# EAGLE schematic BMS_25 (EAGLE 9.6.2)
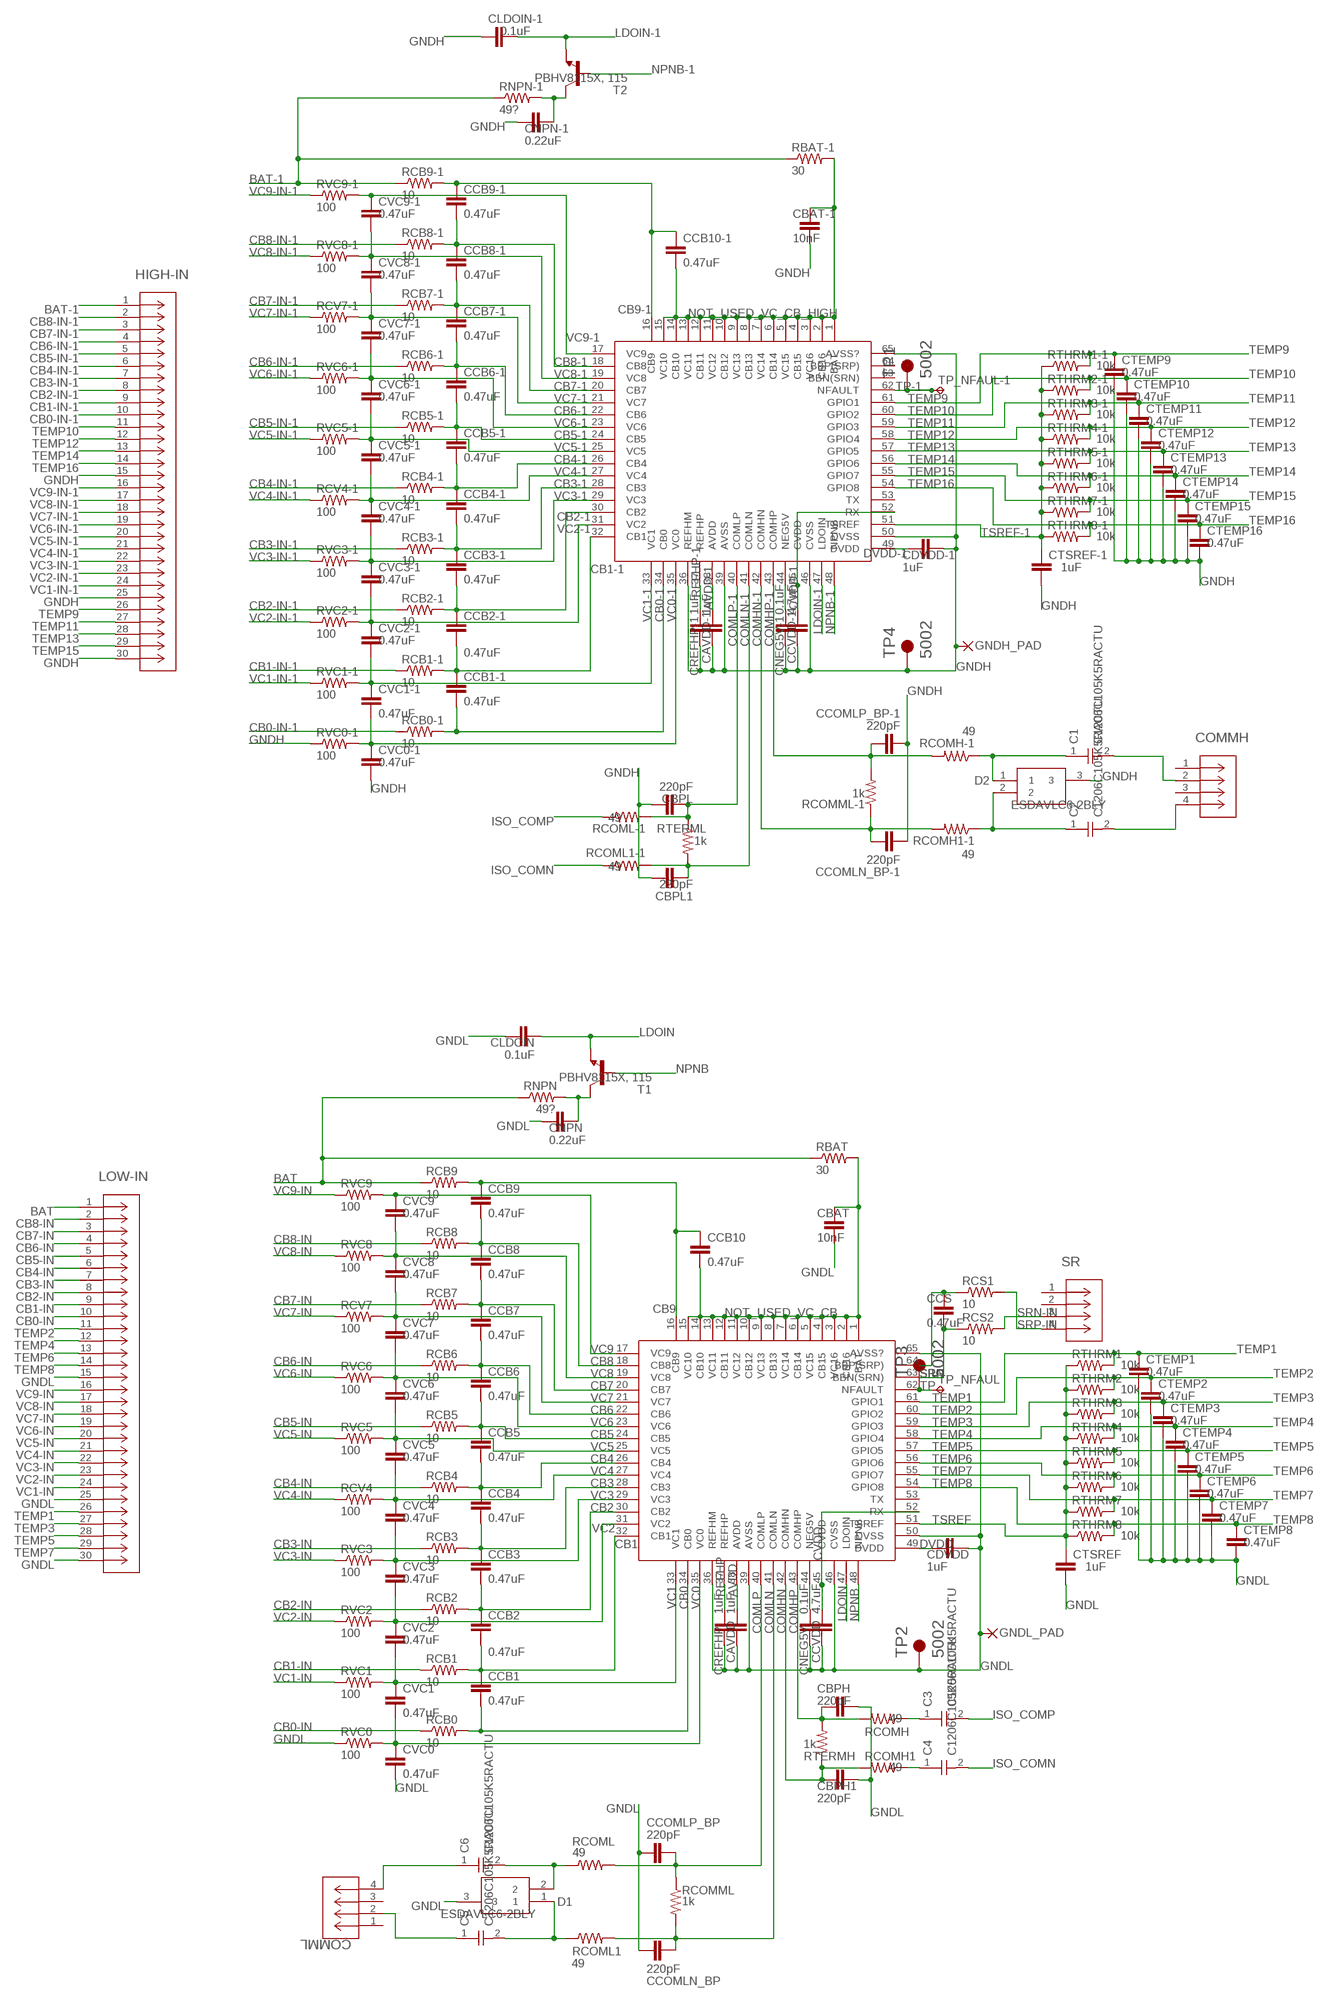
[diagram p0: schematic, sheet 1]

## Parts
C1  C1206C105K5RACTU  [CAPC3216X120N]
C2  C1206C105K5RACTU  [CAPC3216X120N]
C3  C1206C105K5RACTU  [CAPC3216X120N]
C4  C1206C105K5RACTU  [CAPC3216X120N]
C5  C1206C105K5RACTU  [CAPC3216X120N]
C6  C1206C105K5RACTU  [CAPC3216X120N]
CAVDD  1uF  CAPACITORC0603  [C0603]
CAVDD-1  1uF  CAPACITORC0603  [C0603]
CBAT  10nF  CAPACITORC0603  [C0603]
CBAT-1  10nF  CAPACITORC0603  [C0603]
CBPH  220pF  CAPACITORC0603  [C0603]
CBPH1  220pF  CAPACITORC0603  [C0603]
CBPL  220pF  CAPACITORC0603  [C0603]
CBPL1  220pF  CAPACITORC0603  [C0603]
CCB1  0.47uF  CAPACITORC0603  [C0603]
CCB1-1  0.47uF  CAPACITORC0603  [C0603]
CCB2  0.47uF  CAPACITORC0603  [C0603]
CCB2-1  0.47uF  CAPACITORC0603  [C0603]
CCB3  0.47uF  CAPACITORC0603  [C0603]
CCB3-1  0.47uF  CAPACITORC0603  [C0603]
CCB4  0.47uF  CAPACITORC0603  [C0603]
CCB4-1  0.47uF  CAPACITORC0603  [C0603]
CCB5  0.47uF  CAPACITORC0603  [C0603]
CCB5-1  0.47uF  CAPACITORC0603  [C0603]
CCB6  0.47uF  CAPACITORC0603  [C0603]
CCB6-1  0.47uF  CAPACITORC0603  [C0603]
CCB7  0.47uF  CAPACITORC0603  [C0603]
CCB7-1  0.47uF  CAPACITORC0603  [C0603]
CCB8  0.47uF  CAPACITORC0603  [C0603]
CCB8-1  0.47uF  CAPACITORC0603  [C0603]
CCB9  0.47uF  CAPACITORC0603  [C0603]
CCB9-1  0.47uF  CAPACITORC0603  [C0603]
CCB10  0.47uF  CAPACITORC0603  [C0603]
CCB10-1  0.47uF  CAPACITORC0603  [C0603]
CCOMLN_BP  220pF  CAPACITORC0603  [C0603]
CCOMLN_BP-1  220pF  CAPACITORC0603  [C0603]
CCOMLP_BP  220pF  CAPACITORC0603  [C0603]
CCOMLP_BP-1  220pF  CAPACITORC0603  [C0603]
CCS  0.47uF  CAPACITORC0603  [C0603]
CCVDD  4.7uF  CAPACITORC0603  [C0603]
CCVDD-1  4.7uF  CAPACITORC0603  [C0603]
CDVDD  1uF  CAPACITORC0603  [C0603]
CDVDD-1  1uF  CAPACITORC0603  [C0603]
CLDOIN  0.1uF  CAPACITORC0603  [C0603]
CLDOIN-1  0.1uF  CAPACITORC0603  [C0603]
CNEG5V  0.1uF  CAPACITORC0603  [C0603]
CNEG5V-1  0.1uF  CAPACITORC0603  [C0603]
CNPN  0.22uF  CAPACITORC0603  [C0603]
CNPN-1  0.22uF  CAPACITORC0603  [C0603]
COMMH  DF11-4DP-2DSA(24)  [CON4_2X2_UF_DF11_HIR]
COMML  DF11-4DP-2DSA(24)  [CON4_2X2_UF_DF11_HIR]
CREFHP  1uF  CAPACITORC0603  [C0603]
CREFHP-1  1uF  CAPACITORC0603  [C0603]
CTEMP1  0.47uF  CAPACITORC0603  [C0603]
CTEMP2  0.47uF  CAPACITORC0603  [C0603]
CTEMP3  0.47uF  CAPACITORC0603  [C0603]
CTEMP4  0.47uF  CAPACITORC0603  [C0603]
CTEMP5  0.47uF  CAPACITORC0603  [C0603]
CTEMP6  0.47uF  CAPACITORC0603  [C0603]
CTEMP7  0.47uF  CAPACITORC0603  [C0603]
CTEMP8  0.47uF  CAPACITORC0603  [C0603]
CTEMP9  0.47uF  CAPACITORC0603  [C0603]
CTEMP10  0.47uF  CAPACITORC0603  [C0603]
CTEMP11  0.47uF  CAPACITORC0603  [C0603]
CTEMP12  0.47uF  CAPACITORC0603  [C0603]
CTEMP13  0.47uF  CAPACITORC0603  [C0603]
CTEMP14  0.47uF  CAPACITORC0603  [C0603]
CTEMP15  0.47uF  CAPACITORC0603  [C0603]
CTEMP16  0.47uF  CAPACITORC0603  [C0603]
CTSREF  1uF  CAPACITORC0603  [C0603]
CTSREF-1  1uF  CAPACITORC0603  [C0603]
CVC0  0.47uF  CAPACITORC0603  [C0603]
CVC0-1  0.47uF  CAPACITORC0603  [C0603]
CVC1  0.47uF  CAPACITORC0603  [C0603]
CVC1-1  0.47uF  CAPACITORC0603  [C0603]
CVC2  0.47uF  CAPACITORC0603  [C0603]
CVC2-1  0.47uF  CAPACITORC0603  [C0603]
CVC3  0.47uF  CAPACITORC0603  [C0603]
CVC3-1  0.47uF  CAPACITORC0603  [C0603]
CVC4  0.47uF  CAPACITORC0603  [C0603]
CVC4-1  0.47uF  CAPACITORC0603  [C0603]
CVC5  0.47uF  CAPACITORC0603  [C0603]
CVC5-1  0.47uF  CAPACITORC0603  [C0603]
CVC6  0.47uF  CAPACITORC0603  [C0603]
CVC6-1  0.47uF  CAPACITORC0603  [C0603]
CVC7  0.47uF  CAPACITORC0603  [C0603]
CVC7-1  0.47uF  CAPACITORC0603  [C0603]
CVC8  0.47uF  CAPACITORC0603  [C0603]
CVC8-1  0.47uF  CAPACITORC0603  [C0603]
CVC9  0.47uF  CAPACITORC0603  [C0603]
CVC9-1  0.47uF  CAPACITORC0603  [C0603]
D1  ESDAVLC6-2BLY  [SOT95P255X150-3N]
D2  ESDAVLC6-2BLY  [SOT95P255X150-3N]
GNDH_PAD  SMD2  [SMD1,27-2,54]
GNDL_PAD  SMD2  [SMD1,27-2,54]
HIGH-IN  87606-315LF  [87606-315LF_AMP]
IC1  PBQ79656PAPTQ1  [QFP50P1200X1200X120-65N]
IC2  PBQ79656PAPTQ1  [QFP50P1200X1200X120-65N]
LOW-IN  87606-315LF  [87606-315LF_AMP]
RBAT  30  RESISTORR0603  [R0603]
RBAT-1  30  RESISTORR0603  [R0603]
RCB0  10  R-US_R2010  [R2010]
RCB0-1  10  R-US_R2010  [R2010]
RCB1  10  R-US_R2010  [R2010]
RCB1-1  10  R-US_R2010  [R2010]
RCB2  10  R-US_R2010  [R2010]
RCB2-1  10  R-US_R2010  [R2010]
RCB3  10  R-US_R2010  [R2010]
RCB3-1  10  R-US_R2010  [R2010]
RCB4  10  R-US_R2010  [R2010]
RCB4-1  10  R-US_R2010  [R2010]
RCB5  10  R-US_R2010  [R2010]
RCB5-1  10  R-US_R2010  [R2010]
RCB6  10  R-US_R2010  [R2010]
RCB6-1  10  R-US_R2010  [R2010]
RCB7  10  R-US_R2010  [R2010]
RCB7-1  10  R-US_R2010  [R2010]
RCB8  10  R-US_R2010  [R2010]
RCB8-1  10  R-US_R2010  [R2010]
RCB9  10  R-US_R2010  [R2010]
RCB9-1  10  R-US_R2010  [R2010]
RCOMH  49  RESISTORR0603  [R0603]
RCOMH1  49  RESISTORR0603  [R0603]
RCOMH1-1  49  RESISTORR0603  [R0603]
RCOMH-1  49  RESISTORR0603  [R0603]
RCOML  49  RESISTORR0603  [R0603]
RCOML1  49  RESISTORR0603  [R0603]
RCOML1-1  49  RESISTORR0603  [R0603]
RCOML-1  49  RESISTORR0603  [R0603]
RCOMML  1k  RESISTORR0603  [R0603]
RCOMML-1  1k  RESISTORR0603  [R0603]
RCS1  10  RESISTORR0603  [R0603]
RCS2  10  RESISTORR0603  [R0603]
RCV4  100  RESISTORR0603  [R0603]
RCV4-1  100  RESISTORR0603  [R0603]
RCV7  100  RESISTORR0603  [R0603]
RCV7-1  100  RESISTORR0603  [R0603]
RNPN  49?  RESISTORR0603  [R0603]
RNPN-1  49?  RESISTORR0603  [R0603]
RTERMH  1k  RESISTORR0603  [R0603]
RTERML  1k  RESISTORR0603  [R0603]
RTHRM1  10k  RESISTORR0603  [R0603]
RTHRM1-1  10k  RESISTORR0603  [R0603]
RTHRM2  10k  RESISTORR0603  [R0603]
RTHRM2-1  10k  RESISTORR0603  [R0603]
RTHRM3  10k  RESISTORR0603  [R0603]
RTHRM3-1  10k  RESISTORR0603  [R0603]
RTHRM4  10k  RESISTORR0603  [R0603]
RTHRM4-1  10k  RESISTORR0603  [R0603]
RTHRM5  10k  RESISTORR0603  [R0603]
RTHRM5-1  10k  RESISTORR0603  [R0603]
RTHRM6  10k  RESISTORR0603  [R0603]
RTHRM6-1  10k  RESISTORR0603  [R0603]
RTHRM7  10k  RESISTORR0603  [R0603]
RTHRM7-1  10k  RESISTORR0603  [R0603]
RTHRM8  10k  RESISTORR0603  [R0603]
RTHRM8-1  10k  RESISTORR0603  [R0603]
RVC0  100  RESISTORR0603  [R0603]
RVC0-1  100  RESISTORR0603  [R0603]
RVC1  100  RESISTORR0603  [R0603]
RVC1-1  100  RESISTORR0603  [R0603]
RVC2  100  RESISTORR0603  [R0603]
RVC2-1  100  RESISTORR0603  [R0603]
RVC3  100  RESISTORR0603  [R0603]
RVC3-1  100  RESISTORR0603  [R0603]
RVC5  100  RESISTORR0603  [R0603]
RVC5-1  100  RESISTORR0603  [R0603]
RVC6  100  RESISTORR0603  [R0603]
RVC6-1  100  RESISTORR0603  [R0603]
RVC8  100  RESISTORR0603  [R0603]
RVC8-1  100  RESISTORR0603  [R0603]
RVC9  100  RESISTORR0603  [R0603]
RVC9-1  100  RESISTORR0603  [R0603]
SR  DF11-4DP-2DSA(24)  [CON4_2X2_UF_DF11_HIR]
T1  PBHV8115X, 115  BC868-NPN-SOT89-BCE  [SOT89-BCE]
T2  PBHV8115X, 115  BC868-NPN-SOT89-BCE  [SOT89-BCE]
TP1  5002  [KEYSTONE_5002]
TP2  5002  [KEYSTONE_5002]
TP3  5002  [KEYSTONE_5002]
TP4  5002  [KEYSTONE_5002]
TP_NFAUL  TPB2,54  [B2,54]
TP_NFAUL-1  TPB2,54  [B2,54]

## Nets
AVDD: CAVDD.1 IC2.38(AVDD)
AVDD-1: CAVDD-1.1 IC1.38(AVDD)
BAT: LOW-IN.1 RBAT.1 RCB9.1 RNPN.1
BAT-1: HIGH-IN.1 RBAT-1.1 RCB9-1.1 RNPN-1.1
CB0: CCB1.2 IC2.34(CB0) RCB0.2
CB0-1: CCB1-1.2 IC1.34(CB0) RCB0-1.2
CB0-IN: LOW-IN.10 RCB0.1
CB0-IN-1: HIGH-IN.10 RCB0-1.1
CB1: CCB1.1 CCB2.2 IC2.32(CB1) RCB1.2
CB1-1: CCB1-1.1 CCB2-1.2 IC1.32(CB1) RCB1-1.2
CB1-IN: LOW-IN.9 RCB1.1
CB1-IN-1: HIGH-IN.9 RCB1-1.1
CB2: CCB2.1 CCB3.2 IC2.30(CB2) RCB2.2
CB2-1: CCB2-1.1 CCB3-1.2 IC1.30(CB2) RCB2-1.2
CB2-IN: LOW-IN.8 RCB2.1
CB2-IN-1: HIGH-IN.8 RCB2-1.1
CB3: CCB3.1 CCB4.2 IC2.28(CB3) RCB3.2
CB3-1: CCB3-1.1 CCB4-1.2 IC1.28(CB3) RCB3-1.2
CB3-IN: LOW-IN.7 RCB3.1
CB3-IN-1: HIGH-IN.7 RCB3-1.1
CB4: CCB4.1 CCB5.2 IC2.26(CB4) RCB4.2
CB4-1: CCB4-1.1 CCB5-1.2 IC1.26(CB4) RCB4-1.2
CB4-IN: LOW-IN.6 RCB4.1
CB4-IN-1: HIGH-IN.6 RCB4-1.1
CB5: CCB5.1 CCB6.2 IC2.24(CB5) RCB5.2
CB5-1: CCB5-1.1 CCB6-1.2 IC1.24(CB5) RCB5-1.2
CB5-IN: LOW-IN.5 RCB5.1
CB5-IN-1: HIGH-IN.5 RCB5-1.1
CB6: CCB6.1 CCB7.2 IC2.22(CB6) RCB6.2
CB6-1: CCB6-1.1 CCB7-1.2 IC1.22(CB6) RCB6-1.2
CB6-IN: LOW-IN.4 RCB6.1
CB6-IN-1: HIGH-IN.4 RCB6-1.1
CB7: CCB7.1 CCB8.2 IC2.20(CB7) RCB7.2
CB7-1: CCB7-1.1 CCB8-1.2 IC1.20(CB7) RCB7-1.2
CB7-IN: LOW-IN.3 RCB7.1
CB7-IN-1: HIGH-IN.3 RCB7-1.1
CB8: CCB8.1 CCB9.2 IC2.18(CB8) RCB8.2
CB8-1: CCB8-1.1 CCB9-1.2 IC1.18(CB8) RCB8-1.2
CB8-IN: LOW-IN.2 RCB8.1
CB8-IN-1: HIGH-IN.2 RCB8-1.1
CB9: CCB9.1 CCB10.2 IC2.16(CB9) RCB9.2
CB9-1: CCB9-1.1 CCB10-1.2 IC1.16(CB9) RCB9-1.2
COMHN: CBPH1.1 IC2.42(COMHN) RCOMH1.2 RTERMH.1
COMHN-1: CCOMLN_BP-1.1 IC1.42(COMHN) RCOMH1-1.2 RCOMML-1.1
COMHP: CBPH.1 IC2.43(COMHP) RCOMH.2 RTERMH.2
COMHP-1: CCOMLP_BP-1.1 IC1.43(COMHP) RCOMH-1.2 RCOMML-1.2
COMLN: CCOMLN_BP.1 IC2.41(COMLN) RCOML1.2 RCOMML.2
COMLN-1: CBPL1.1 IC1.41(COMLN) RCOML1-1.2 RTERML.2
COMLP: CCOMLP_BP.1 IC2.40(COMLP) RCOML.2 RCOMML.1
COMLP-1: CBPL.1 IC1.40(COMLP) RCOML-1.2 RTERML.1
CVDD: CCVDD.1 IC2.45(CVDD) IC2.52(RX)
CVDD-1: CCVDD-1.1 IC1.45(CVDD) IC1.52(RX)
DVDD: CDVDD.1 IC2.49(DVDD)
DVDD-1: CDVDD-1.1 IC1.49(DVDD)
GNDH: CAVDD-1.2 CBAT-1.1 CBPL1.2 CBPL.2 CCOMLN_BP-1.2 CCOMLP_BP-1.2 CCVDD-1.2 CDVDD-1.2 CLDOIN-1.2 CNEG5V-1.2 CNPN-1.1 CREFHP-1.2 CTEMP9.2 CTEMP10.2 CTEMP11.2 CTEMP12.2 CTEMP13.2 CTEMP14.2 CTEMP15.2 CTEMP16.2 CTSREF-1.2 CVC0-1.2 D2.3 GNDH_PAD.1(P) HIGH-IN.15 HIGH-IN.25 HIGH-IN.30 IC1.36(REFHM) IC1.39(AVSS) IC1.46(CVSS) IC1.50(DVSS) IC1.65(AVSS?) RVC0-1.1 TP4.TP
GNDL: CAVDD.2 CBAT.1 CBPH1.2 CBPH.2 CCOMLN_BP.2 CCOMLP_BP.2 CCVDD.2 CDVDD.2 CLDOIN.2 CNEG5V.2 CNPN.1 CREFHP.2 CTEMP1.2 CTEMP2.2 CTEMP3.2 CTEMP4.2 CTEMP5.2 CTEMP6.2 CTEMP7.2 CTEMP8.2 CTSREF.2 CVC0.2 D1.3 GNDL_PAD.1(P) IC2.36(REFHM) IC2.39(AVSS) IC2.46(CVSS) IC2.50(DVSS) IC2.65(AVSS?) LOW-IN.15 LOW-IN.25 LOW-IN.30 RVC0.1 TP2.TP
ISO_COMN: C4.2(B) RCOML1-1.1
ISO_COMP: C3.2(B) RCOML-1.1
LDOIN: CLDOIN.1 IC2.47(LDOIN) T1.E
LDOIN-1: CLDOIN-1.1 IC1.47(LDOIN) T2.E
N$2: CNPN.2 RNPN.2 T1.C
N$6: CNEG5V.1 IC2.44(NEG5V)
N$46: C3.1(A) RCOMH.1
N$47: C4.1(A) RCOMH1.1
N$50: C5.2(B) D1.1 RCOML1.1
N$51: C6.2(B) D1.2 RCOML.1
N$73: CNEG5V-1.1 IC1.44(NEG5V)
N$92: CNPN-1.2 RNPN-1.2 T2.C
N$97: C1.1(A) D2.1 RCOMH-1.1
N$98: C2.1(A) D2.2 RCOMH1-1.1
N$99: C1.2(B) COMMH.2
N$101: C2.2(B) COMMH.4
N$103: C5.1(A) COMML.2
N$104: C6.1(A) COMML.4
NOT_USED_VC_CB: CBAT.2 CCB10.1 IC2.1(BAT) IC2.2(CB16) IC2.3(VC16) IC2.4(CB15) IC2.5(VC15) IC2.6(CB14) IC2.7(VC14) IC2.8(CB13) IC2.9(VC13) IC2.10(CB12) IC2.11(VC12) IC2.12(CB11) IC2.13(VC11) IC2.14(CB10) IC2.15(VC10) RBAT.2
NOT_USED_VC_CB_HIGH: CBAT-1.2 CCB10-1.1 IC1.1(BAT) IC1.2(CB16) IC1.3(VC16) IC1.4(CB15) IC1.5(VC15) IC1.6(CB14) IC1.7(VC14) IC1.8(CB13) IC1.9(VC13) IC1.10(CB12) IC1.11(VC12) IC1.12(CB11) IC1.13(VC11) IC1.14(CB10) IC1.15(VC10) RBAT-1.2
NPNB: IC2.48(NPNB) T1.B
NPNB-1: IC1.48(NPNB) T2.B
REFHP: CREFHP.1 IC2.37(REFHP)
REFHP-1: CREFHP-1.1 IC1.37(REFHP)
SRN: CCS.1 IC2.63(BBN(SRN)) RCS2.1
SRN-IN: RCS2.2 SR.3
SRP: CCS.2 IC2.64(BBP(SRP)) RCS1.1
SRP-IN: RCS1.2 SR.4
TEMP1: CTEMP1.1 IC2.61(GPIO1) LOW-IN.26 RTHRM1.2
TEMP2: CTEMP2.1 IC2.60(GPIO2) LOW-IN.11 RTHRM2.2
TEMP3: CTEMP3.1 IC2.59(GPIO3) LOW-IN.27 RTHRM3.2
TEMP4: CTEMP4.1 IC2.58(GPIO4) LOW-IN.12 RTHRM4.2
TEMP5: CTEMP5.1 IC2.57(GPIO5) LOW-IN.28 RTHRM5.2
TEMP6: CTEMP6.1 IC2.56(GPIO6) LOW-IN.13 RTHRM6.2
TEMP7: CTEMP7.1 IC2.55(GPIO7) LOW-IN.29 RTHRM7.2
TEMP8: CTEMP8.1 IC2.54(GPIO8) LOW-IN.14 RTHRM8.2
TEMP9: CTEMP9.1 HIGH-IN.26 IC1.61(GPIO1) RTHRM1-1.2
TEMP10: CTEMP10.1 HIGH-IN.11 IC1.60(GPIO2) RTHRM2-1.2
TEMP11: CTEMP11.1 HIGH-IN.27 IC1.59(GPIO3) RTHRM3-1.2
TEMP12: CTEMP12.1 HIGH-IN.12 IC1.58(GPIO4) RTHRM4-1.2
TEMP13: CTEMP13.1 HIGH-IN.28 IC1.57(GPIO5) RTHRM5-1.2
TEMP14: CTEMP14.1 HIGH-IN.13 IC1.56(GPIO6) RTHRM6-1.2
TEMP15: CTEMP15.1 HIGH-IN.29 IC1.55(GPIO7) RTHRM7-1.2
TEMP16: CTEMP16.1 HIGH-IN.14 IC1.54(GPIO8) RTHRM8-1.2
TP: IC2.62(NFAULT) TP3.TP TP_NFAUL.TP
TP-1: IC1.62(NFAULT) TP1.TP TP_NFAUL-1.TP
TSREF: CTSREF.1 IC2.51(TSREF) RTHRM1.1 RTHRM2.1 RTHRM3.1 RTHRM4.1 RTHRM5.1 RTHRM6.1 RTHRM7.1 RTHRM8.1
TSREF-1: CTSREF-1.1 IC1.51(TSREF) RTHRM1-1.1 RTHRM2-1.1 RTHRM3-1.1 RTHRM4-1.1 RTHRM5-1.1 RTHRM6-1.1 RTHRM7-1.1 RTHRM8-1.1
VC0: CVC0.1 CVC1.2 IC2.35(VC0) RVC0.2
VC0-1: CVC0-1.1 CVC1-1.2 IC1.35(VC0) RVC0-1.2
VC1: CVC1.1 CVC2.2 IC2.33(VC1) RVC1.2
VC1-1: CVC1-1.1 CVC2-1.2 IC1.33(VC1) RVC1-1.2
VC1-IN: LOW-IN.24 RVC1.1
VC1-IN-1: HIGH-IN.24 RVC1-1.1
VC2: CVC2.1 CVC3.2 IC2.31(VC2) RVC2.2
VC2-1: CVC2-1.1 CVC3-1.2 IC1.31(VC2) RVC2-1.2
VC2-IN: LOW-IN.23 RVC2.1
VC2-IN-1: HIGH-IN.23 RVC2-1.1
VC3: CVC3.1 CVC4.2 IC2.29(VC3) RVC3.2
VC3-1: CVC3-1.1 CVC4-1.2 IC1.29(VC3) RVC3-1.2
VC3-IN: LOW-IN.22 RVC3.1
VC3-IN-1: HIGH-IN.22 RVC3-1.1
VC4: CVC4.1 CVC5.2 IC2.27(VC4) RCV4.2
VC4-1: CVC4-1.1 CVC5-1.2 IC1.27(VC4) RCV4-1.2
VC4-IN: LOW-IN.21 RCV4.1
VC4-IN-1: HIGH-IN.21 RCV4-1.1
VC5: CVC5.1 CVC6.2 IC2.25(VC5) RVC5.2
VC5-1: CVC5-1.1 CVC6-1.2 IC1.25(VC5) RVC5-1.2
VC5-IN: LOW-IN.20 RVC5.1
VC5-IN-1: HIGH-IN.20 RVC5-1.1
VC6: CVC6.1 CVC7.2 IC2.23(VC6) RVC6.2
VC6-1: CVC6-1.1 CVC7-1.2 IC1.23(VC6) RVC6-1.2
VC6-IN: LOW-IN.19 RVC6.1
VC6-IN-1: HIGH-IN.19 RVC6-1.1
VC7: CVC7.1 CVC8.2 IC2.21(VC7) RCV7.2
VC7-1: CVC7-1.1 CVC8-1.2 IC1.21(VC7) RCV7-1.2
VC7-IN: LOW-IN.18 RCV7.1
VC7-IN-1: HIGH-IN.18 RCV7-1.1
VC8: CVC8.1 CVC9.2 IC2.19(VC8) RVC8.2
VC8-1: CVC8-1.1 CVC9-1.2 IC1.19(VC8) RVC8-1.2
VC8-IN: LOW-IN.17 RVC8.1
VC8-IN-1: HIGH-IN.17 RVC8-1.1
VC9: CVC9.1 IC2.17(VC9) RVC9.2
VC9-1: CVC9-1.1 IC1.17(VC9) RVC9-1.2
VC9-IN: LOW-IN.16 RVC9.1
VC9-IN-1: HIGH-IN.16 RVC9-1.1
Unconnected: COMMH.1 COMMH.3 COMML.1 COMML.3 IC1.53(TX) IC1.63(BBN(SRN)) IC1.64(BBP(SRP)) IC2.53(TX) SR.1 SR.2

## Library data of the parts
C1-C6 = C1206C105K5RACTU:C1206C105K5RACTU: 1µF ±10% 50V Ceramic Capacitor X7R 1206 (3216 Metric) Check availability <https://pricing.snapeda.com/parts/C1206C105K5RACTU/KEMET/view-part?ref=eda>; AVAILABILITY: In Stock; CHECK_PRICES: https://www.snapeda.com/parts/C1206C105K5RACTU/KEMET/view-part/?ref=eda; DESCRIPTION: 1206 C 1uF Ceramic Multilayer Capacitor, 50 VDC, +125degC, X7R Dielec, +/-10% | KEMET C1206C105K5RACTU; MF: KEMET; MP: C1206C105K5RACTU; PACKAGE: 1206-2 KEMET; PRICE: None; SNAPEDA_LINK: https://www.snapeda.com/parts/C1206C105K5RACTU/KEMET/view-part/?ref=snap
CAVDD CAVDD-1 CBAT CBAT-1 CBPH CBPH1 CBPL CBPL1 CCB1 CCB1-1 CCB2 CCB2-1 CCB3 CCB3-1 CCB4 CCB4-1 CCB5 CCB5-1 CCB6 CCB6-1 CCB7 CCB7-1 CCB8 CCB8-1 CCB9 CCB9-1 CCB10 CCB10-1 CCOMLN_BP CCOMLN_BP-1 CCOMLP_BP CCOMLP_BP-1 CCS CCVDD CCVDD-1 CDVDD CDVDD-1 CLDOIN CLDOIN-1 CNEG5V CNEG5V-1 CNPN CNPN-1 CREFHP CREFHP-1 CTEMP1-CTEMP16 CTSREF CTSREF-1 CVC0 CVC0-1 CVC1 CVC1-1 CVC2 CVC2-1 CVC3 CVC3-1 CVC4 CVC4-1 CVC5 CVC5-1 CVC6 CVC6-1 CVC7 CVC7-1 CVC8 CVC8-1 CVC9 CVC9-1 = NFR23_v1.3:CAPACITOR: CAPACITOR, European symbol; SPICEPREFIX: C
COMMH COMML SR = BMS24:DF11-4DP-2DSA(24); COPYRIGHT: Copyright (C) 2023 Ultra Librarian. All rights reserved.; MANUFACTURER_PART_NUMBER: DF11-4DP-2DSA(24); MFR_NAME: Hirose
D1 D2 = ESDAVLC6-2BLY:ESDAVLC6-2BLY: STMICROELECTRONICS - ESDAVLC6-2BLY - ESD Protection Device, 17 V, SOT-23, 3 Pins, 5 V, 140 W, ESDA Transil Series Source: Datasheet <http://www.st.com/resource/en/datasheet/esdavlc6-2bly.pdf>; DESCRIPTION: STMICROELECTRONICS - ESDAVLC6-2BLY - ESD Protection Device, 17 V, SOT-23, 3 Pins, 5 V, 140 W, ESDA Transil Series; HEIGHT: 1.5mm; MANUFACTURER_NAME: STMicroelectronics; MANUFACTURER_PART_NUMBER: ESDAVLC6-2BLY; MOUSER_PART_NUMBER: 511-ESDAVLC6-2BLY; MOUSER_PRICE-STOCK: https://www.mouser.co.uk/ProductDetail/STMicroelectronics/ESDAVLC6-2BLY?qs=l7cgNqFNU1iH2e21evvYsA%3D%3D
GNDH_PAD GNDL_PAD = wirepad:SMD2: SMD PAD
HIGH-IN LOW-IN = BMS24:87606-315LF; COPYRIGHT: Copyright (C) 2024 Ultra Librarian. All rights reserved.; MANUFACTURER_PART_NUMBER: 87606-315LF; MFR_NAME: Amphenol ICC
IC1 IC2 = PBQ79656PAPTQ1:PBQ79656PAPTQ1: BQ7965x-Q1 Family of 12S, 14S, 16S Precision Automotive Battery Monitor, Balancer and Integrated Hardware Protector with up to SafeTITM-26262 ASIL-D Compliance Source: Datasheet <http://www.ti.com/lit/ds/symlink/bq79616-q1.pdf>; DESCRIPTION: BQ7965x-Q1 Family of 12S, 14S, 16S Precision Automotive Battery Monitor, Balancer and Integrated Hardware Protector with up to SafeTITM-26262 ASIL-D Compliance; HEIGHT: 1.2mm; MANUFACTURER_NAME: Texas Instruments; MANUFACTURER_PART_NUMBER: PBQ79656PAPTQ1
RBAT RBAT-1 RCOMH RCOMH1 RCOMH1-1 RCOMH-1 RCOML RCOML1 RCOML1-1 RCOML-1 RCOMML RCOMML-1 RCS1 RCS2 RCV4 RCV4-1 RCV7 RCV7-1 RNPN RNPN-1 RTERMH RTERML RTHRM1 RTHRM1-1 RTHRM2 RTHRM2-1 RTHRM3 RTHRM3-1 RTHRM4 RTHRM4-1 RTHRM5 RTHRM5-1 RTHRM6 RTHRM6-1 RTHRM7 RTHRM7-1 RTHRM8 RTHRM8-1 RVC0 RVC0-1 RVC1 RVC1-1 RVC2 RVC2-1 RVC3 RVC3-1 RVC5 RVC5-1 RVC6 RVC6-1 RVC8 RVC8-1 RVC9 RVC9-1 = NFR23_v1.3:RESISTOR: RESISTOR, American symbol
RCB0 RCB0-1 RCB1 RCB1-1 RCB2 RCB2-1 RCB3 RCB3-1 RCB4 RCB4-1 RCB5 RCB5-1 RCB6 RCB6-1 RCB7 RCB7-1 RCB8 RCB8-1 RCB9 RCB9-1 = rcl:R-US_: RESISTOR, American symbol; SPICEPREFIX: R
T1 T2 = transistor:*-NPN-: NPN Transistror BF959 corrected 2008.03.06
TP1-TP4 = 5002:5002; MANUFACTURER: Keystone; MAXIMUM_PACKAGE_HEIGHT: 4.57 mm; PARTREV: H; SNAPEDA_PN: 5000; STANDARD: Manufacturer Recommendations
TP_NFAUL TP_NFAUL-1 = testpad:TP: Test pad